# EAGLE schematic 4 PIN Connector (EAGLE 8.0.1)
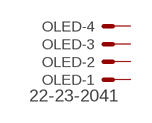
[diagram p0: schematic, sheet 1]

## Parts
OLED  22-23-2041  [22-23-2041]
Unconnected: OLED.1 OLED.2 OLED.3 OLED.4

## Library data of the parts
OLED = con-molex:22-23-2041: .100" (2.54mm) Center Header - 4 Pin; MF: MOLEX; MPN: 22-23-2041; OC_FARNELL: 1462920; OC_NEWARK: 38C0355